# EAGLE schematic v2.2 (EAGLE 7.1.0)
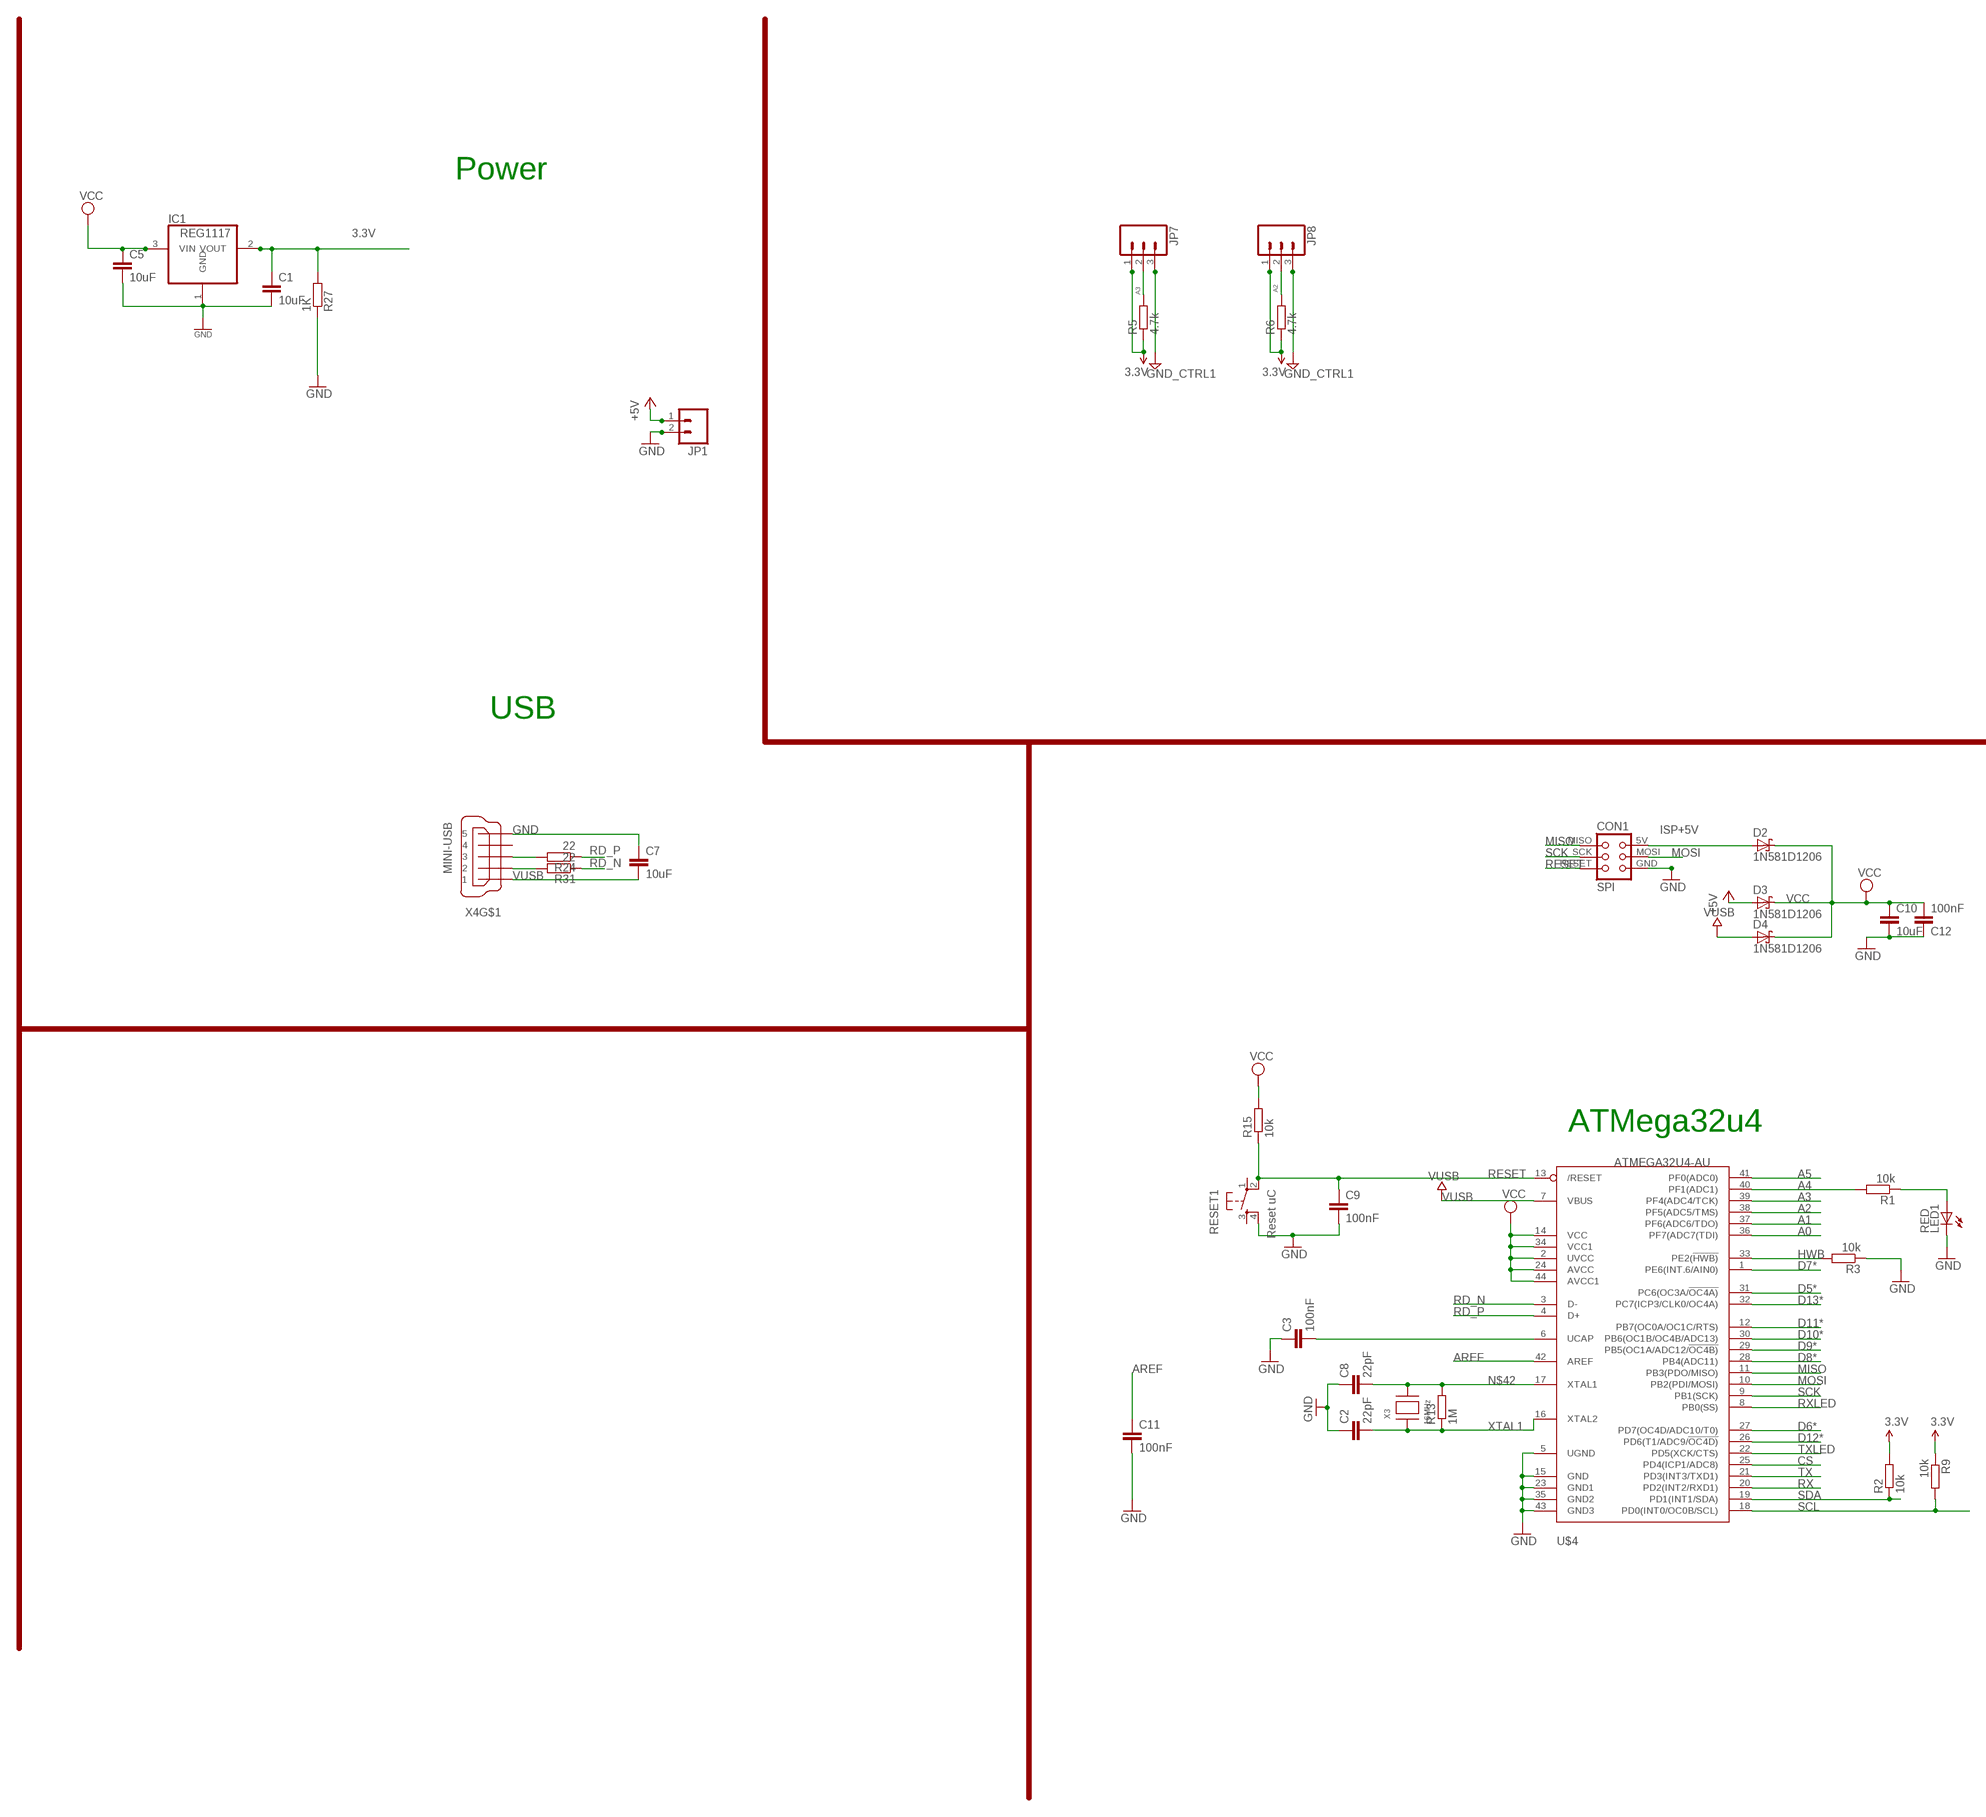
[diagram p0: schematic, sheet 1, part 1 of 2]
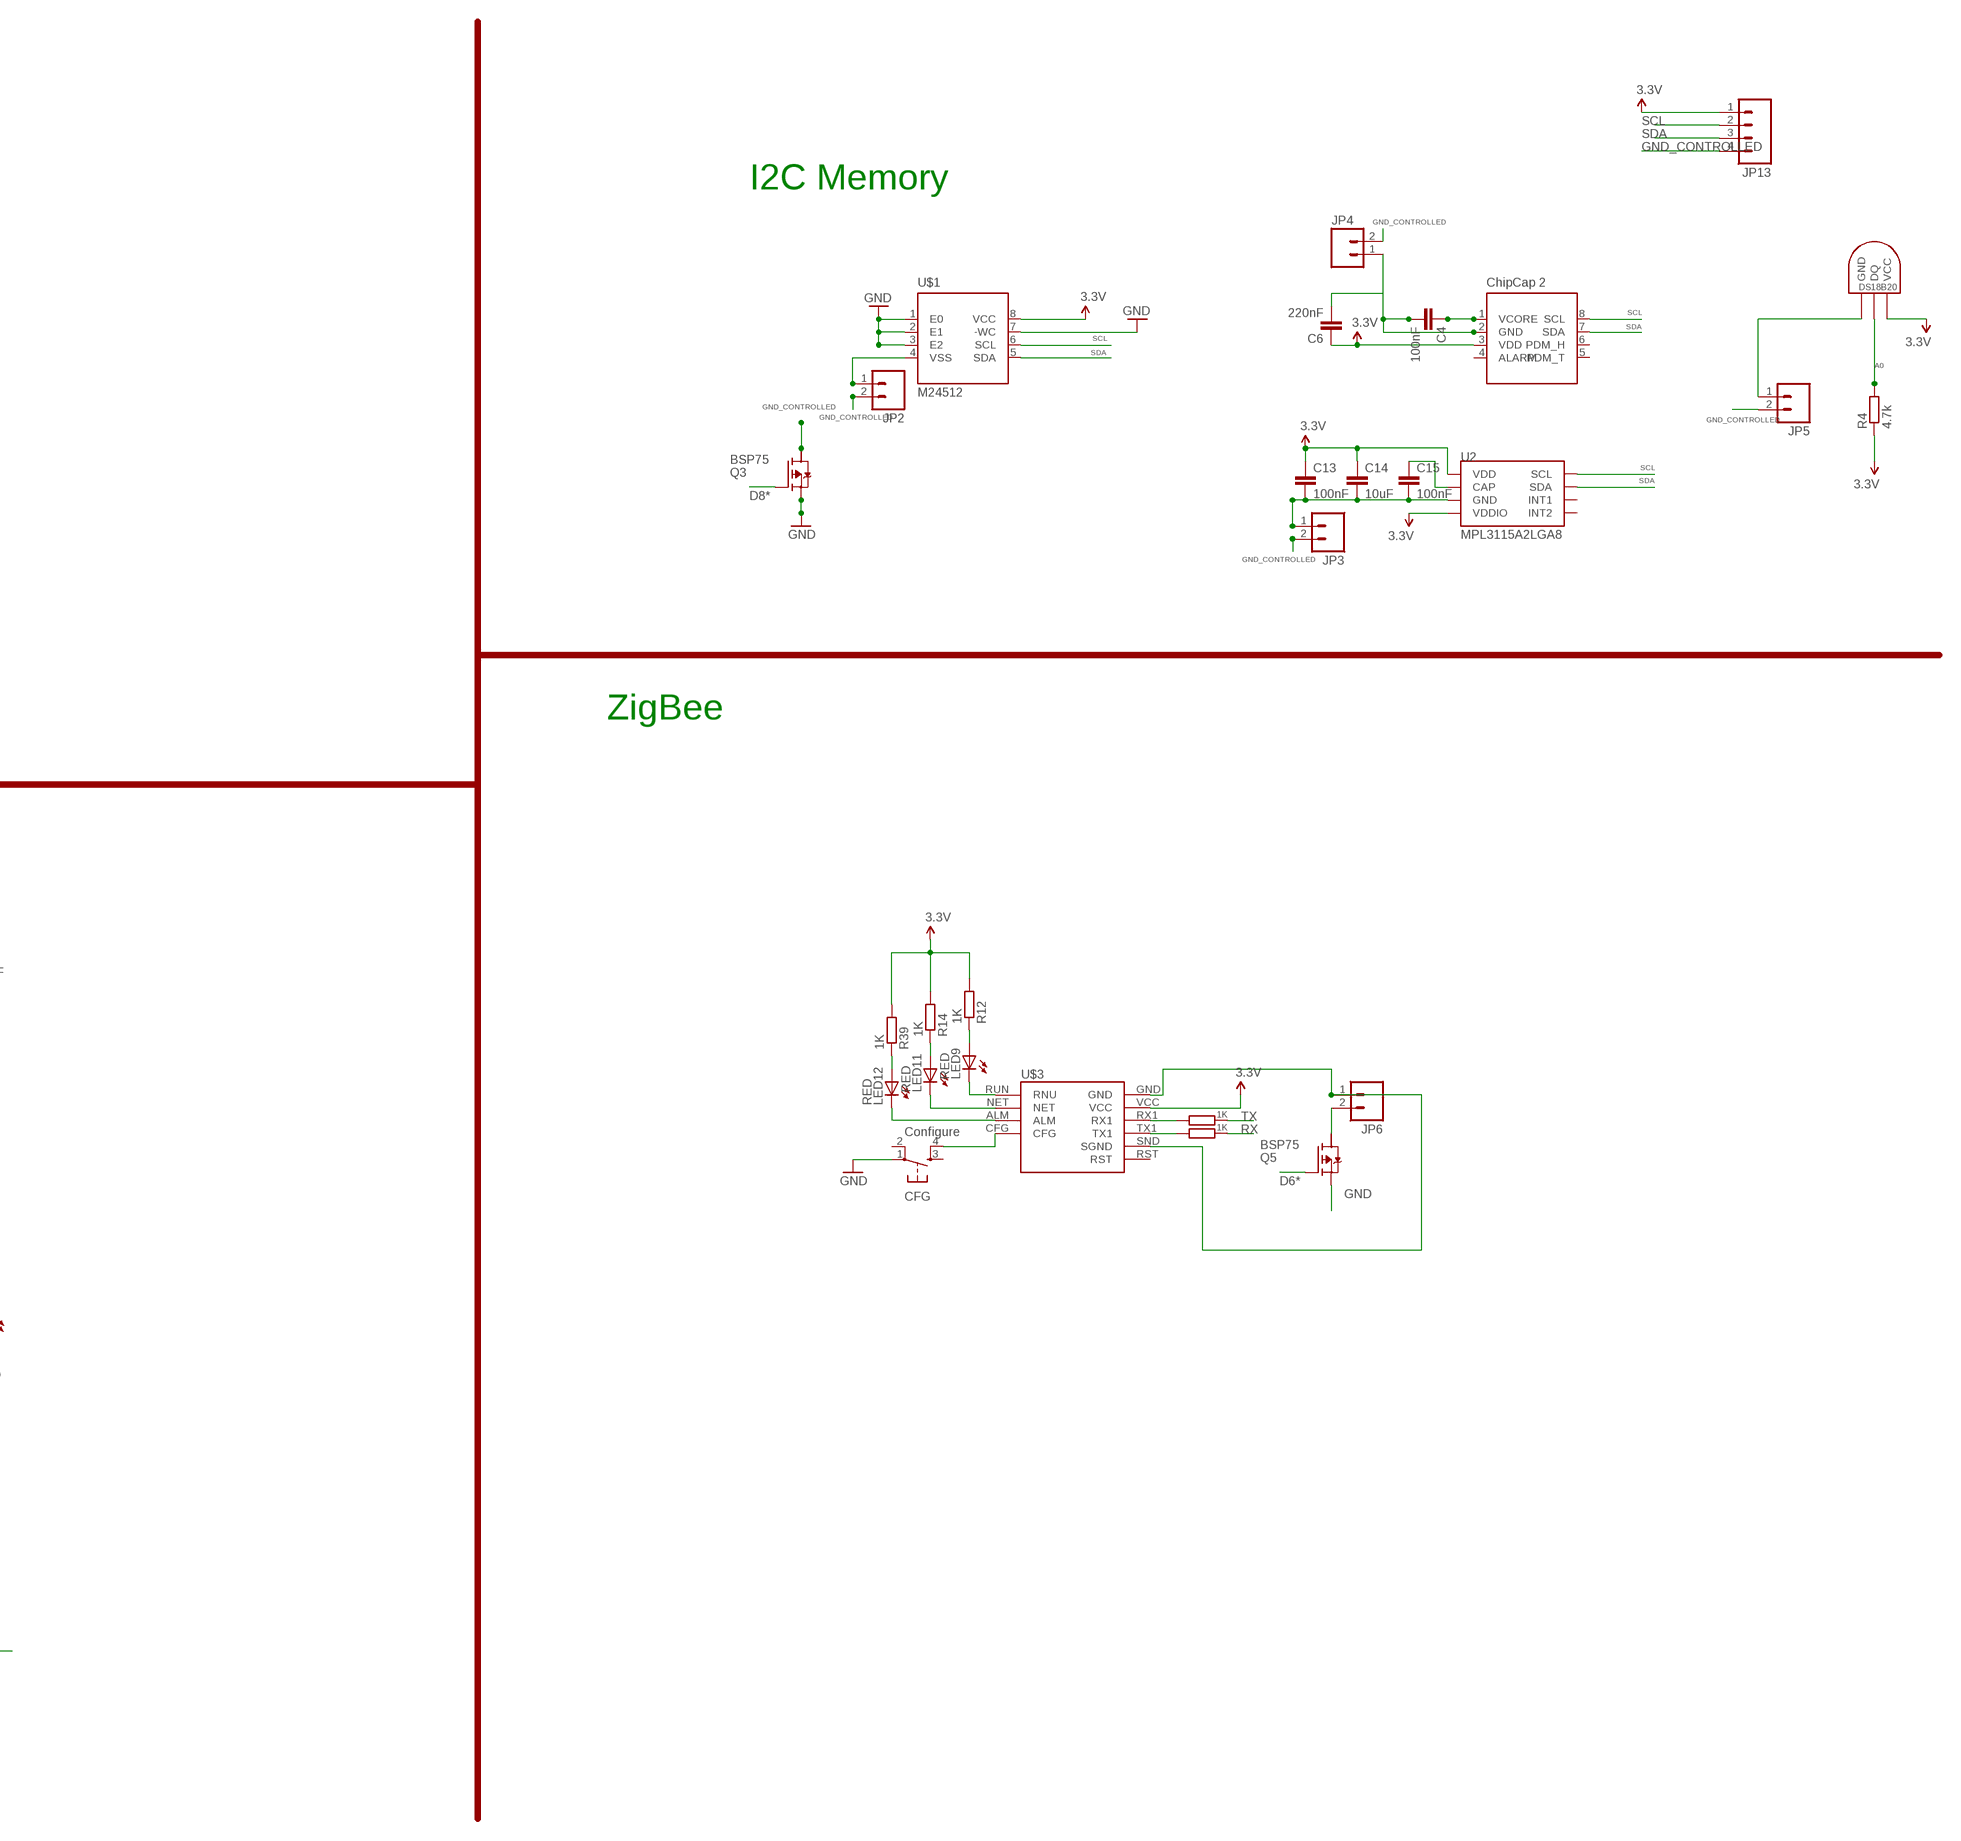
[diagram p1: schematic, sheet 1, part 2 of 2]

## Parts
C1  10uF  C-EUC1206  [C1206]
C2  22pF  C-EUC1206  [C1206]
C3  100nF  C-EUC1206  [C1206]
C4  100nF  C-EUC1206  [C1206]
C5  10uF  C-EUC1206  [C1206]
C6  220nF  C-EUC1206  [C1206]
C7  10uF  C-EUC1206  [C1206]
C8  22pF  C-EUC1206  [C1206]
C9  100nF  C-EUC1206  [C1206]
C10  10uF  C-EUC1206  [C1206]
C11  100nF  C-EUC1206  [C1206]
C12  100nF  C-EUC1206  [C1206]
C13  100nF  C-EUC1206  [C1206]
C14  10uF  C-EUC1206  [C1206]
C15  100nF  C-EUC1206  [C1206]
CFG  Configure  TAC_SWITCHSMD  [TACTILE_SWITCH_SMD]
CON1  SPI  TINYISPT  [TC2030-MCP-NL]
D2  1N581D1206  [LED-1206]
D3  1N581D1206  [LED-1206]
D4  1N581D1206  [LED-1206]
IC1  REG1117  [SOT223]
JP1  M02LOCK_LONGPADS  [1X02_LOCK_LONGPADS]
JP2  M02LOCK_LONGPADS  [1X02_LOCK_LONGPADS]
JP3  M02LOCK_LONGPADS  [1X02_LOCK_LONGPADS]
JP4  M02LOCK_LONGPADS  [1X02_LOCK_LONGPADS]
JP5  M02LOCK_LONGPADS  [1X02_LOCK_LONGPADS]
JP6  M02LOCK_LONGPADS  [1X02_LOCK_LONGPADS]
JP7  M03LONGPADS  [1X03_LONGPADS]
JP8  M03LONGPADS  [1X03_LONGPADS]
JP13  M04LOCK_LONGPADS  [1X04_LOCK_LONGPADS]
LED1  RED  LEDCHIP-LED0805  [CHIP-LED0805]
LED9  RED  LEDCHIP-LED0805  [CHIP-LED0805]
LED11  RED  LEDCHIP-LED0805  [CHIP-LED0805]
LED12  RED  LEDCHIP-LED0805  [CHIP-LED0805]
Q3  BSP75  BSP613P  [PG-SOT-223]
Q5  BSP75  BSP613P  [PG-SOT-223]
R1  10k  R-EU_M1206  [M1206]
R2  10k  R-EU_M1206  [M1206]
R3  10k  R-EU_M1206  [M1206]
R4  4.7k  R-EU_M1206  [M1206]
R5  4.7k  R-EU_M1206  [M1206]
R6  4.7k  R-EU_M1206  [M1206]
R8  1K  R-EU_R0805  [R0805]
R9  10k  R-EU_M1206  [M1206]
R11  1K  R-EU_R0805  [R0805]
R12  1K  R-EU_R0805  [R0805]
R13  1M  R-EU_R1206  [R1206]
R14  1K  R-EU_R0805  [R0805]
R15  10k  R-EU_M0805  [M0805]
R24  22  R-EU_M1206  [M1206]
R27  1K  R-EU_R0805  [R0805]
R31  22  R-EU_M1206  [M1206]
R39  1K  R-EU_R0805  [R0805]
RESET1  Reset uC  TAC_SWITCHSMD  [TACTILE_SWITCH_SMD]
U2  MPL3115A2LGA8  [LGA8]
U$1  M24512  [SO8]
U$2  CHIPCAP  [CHIPCAP]
U$3  SZ05-ZIGBEETHROUGHHOLE  [SZ05-ZIGBEE4]
U$4  ATMEGA32U4-AU  [TQFP44]
U$6  DS1820  [µSOP8]
X3  16MHz  XTALNX6035  [NX6035]
X4  MINI-USB  MINI-USB-SCHIELD-32005-201  [32005-201]

## Nets
3.3V [power]: C1.1 C6.1 C13.1 C14.1 IC1.2(VOUT) JP7.1 JP8.1 JP13.1 R2.2 R4.1 R5.1 R6.1 R9.1 R12.2 R14.2 R27.2 R39.2 U2.1(VDD) U2.4(VDDIO) U$1.8(VCC) U$2.3(VDD) U$3.VCC U$6.8(VCC)
$1: C13.2 C14.2 C15.2 JP3.1 U2.3(GND)
$2: C4.2 C6.2 JP4.1 U$2.2(GND)
$3: JP5.1 U$6.4(GND)
$12: JP2.1 U$1.4(VSS)
+5V [power]: D3.A JP1.1
A0: R4.2 U$4.36(PF7(ADC7(TDI)) U$6.1(DQ)
A1: U$4.37(PF6(ADC6/TDO))
A2: JP8.2 R6.2 U$4.38(PF5(ADC5/TMS))
A3: JP7.2 R5.2 U$4.39(PF4(ADC4/TCK))
A4: R1.2 U$4.40(PF1(ADC1))
A5: U$4.41(PF0(ADC0))
AREF: C11.1 U$4.42(AREF)
CS: U$4.25(PD4(ICP1/ADC8))
D5*: U$4.31(PC6(OC3A/!OC4A))
D6*: Q5.1(G) U$4.27(PD7(OC4D/ADC10/T0))
D7*: U$4.1(PE6(INT.6/AIN0))
D8*: Q3.1(G) U$4.28(PB4(ADC11))
D9*: U$4.29(PB5(OC1A/ADC12/!OC4B))
D10*: U$4.30(PB6(OC1B/OC4B/ADC13))
D11*: U$4.12(PB7(OC0A/OC1C/RTS))
D12*: U$4.26(PD6(T1/ADC9/!OC4D))
D13*: U$4.32(PC7(ICP3/CLK0/OC4A))
D+USB: R24.2 X4.3
D-USB: R31.2 X4.2
GND [power]: C1.2 C2.1 C3.1 C5.2 C7.1 C8.1 C9.2 C10.2 C11.2 C12.1 CFG.1 CON1.GND IC1.1(GND) JP1.2 JP7.3 JP8.3 LED1.C Q3.3(S) Q5.3(S) R3.1 R27.1 RESET1.4 U$1.1(E0) U$1.2(E1) U$1.3(E2) U$1.7(-WC) U$4.5(UGND) U$4.15(GND) U$4.23(GND1) U$4.35(GND2) U$4.43(GND3) X4.5 ; supply symbol labelled GND_CTRL1
GND1 [VIN]: LED9.C U$3.RUN(RNU)
GND2 [VIN]: LED11.C U$3.NET
GND3 [VIN]: LED12.C U$3.ALM
GND_CONTROLLED [power]: JP2.2 JP3.2 JP4.2 JP5.2 JP13.4 Q3.2(D)
HWB: R3.2 U$4.33(PE2(!HWB))
ISP+5V: CON1.5V(VCC) D2.A
MISO: CON1.MISO U$4.11(PB3(PDO/MISO))
MOSI: CON1.MOSI U$4.10(PB2(PDI/MOSI))
N$1: LED1.A R1.1
N$2: JP6.2 Q5.2(D)
N$4 [power]: JP6.1 U$3.GND U$3.SND(SGND)
N$6: C4.1 U$2.1(VCORE)
N$11: R11.2 U$3.RX1
N$13: C15.1 U2.2(CAP)
N$16: C3.2 U$4.6(UCAP)
N$24: R8.2 U$3.TX1
N$25: LED9.A R12.1
N$26: LED11.A R14.1
N$27: LED12.A R39.1
N$35: CFG.4 U$3.CFG
N$42: C8.2 R13.2 U$4.17(XTAL1) X3.P$2
RD_N: R31.1 U$4.3(D-)
RD_P: R24.1 U$4.4(D+)
RESET: C9.1 CON1.RESET R15.1 RESET1.2 U$4.13(/RESET)
RX: R8.1 U$4.20(PD2(INT2/RXD1))
RXLED: U$4.8(PB0(SS))
SCK: CON1.SCK U$4.9(PB1(SCK))
SCL: JP13.2 R9.2 U2.8(SCL) U$1.6(SCL) U$2.8(SCL) U$4.18(PD0(INT0/OC0B/SCL))
SDA: JP13.3 R2.1 U2.7(SDA) U$1.5(SDA) U$2.7(SDA) U$4.19(PD1(INT1/SDA))
TX: R11.1 U$4.21(PD3(INT3/TXD1))
TXLED: U$4.22(PD5(XCK/CTS))
VCC [fine]: C5.1 C10.1 C12.2 D2.C D3.C D4.C IC1.3(VIN) R15.2 U$4.2(UVCC) U$4.14(VCC) U$4.24(AVCC) U$4.34(VCC1) U$4.44(AVCC1)
VUSB: C7.2 D4.A U$4.7(VBUS) X4.1
XTAL1: C2.2 R13.1 U$4.16(XTAL2) X3.P$1
Unconnected: CFG.2 CFG.3 Q3.4(D) Q5.4(D) RESET1.1 RESET1.3 U2.5(INT2) U2.6(INT1) U$2.4(ALARM) U$2.5(PDM_T) U$2.6(PDM_H) U$3.RST X4.4 X4.M1(S:S1) X4.M2(S:S2) X4.M3(S:S3) X4.M4(S:S4)

## Notes on the sheet
- Power
- I2C Memory
- ZigBee
- USB
- ATMega32u4

## Library data of the parts
C1-C15 = rcl:C-EU: CAPACITOR, European symbol
CFG RESET1 = lpatiny:TAC_SWITCH: Momentary Switch Button commonly used for reset or general input. Spark Fun Electronics SKU : COM-00097
CON1 = lpatiny:TINYISP: CONNECTOR
D2-D4 = lpatiny:1N581*: 1.0A SCHOTTKY BARRIER RECTIFIER Source: http://www.diodes.com/datasheets/ds23001.pdf
IC1 = burr-brown:REG1117: 800mA and 1A Low Dropout (LDO) Positive Regulator 1.8V, 2.5V, 2.85V, 3.3V, 5V, and Adj; MPN: REG1117; OC_FARNELL: 1097566; OC_NEWARK: 14P6981
JP1-JP6 = SparkFun:M02: Header 2 Standard 2-pin 0.1" header. Use with straight break away headers (SKU : PRT-00116), right angle break away headers (PRT-00553), swiss pins (PRT-00743), machine pins (PRT-00117), and female headers (PRT-00115). Molex polarized connector foot print use with SKU : PRT-08233 with associated crimp pins and housings.
JP7 JP8 = SparkFun:M03: Header 3 Standard 3-pin 0.1" header. Use with straight break away headers (SKU : PRT-00116), right angle break away headers (PRT-00553), swiss pins (PRT-00743), machine pins (PRT-00117), and female headers (PRT-00115). Molex polarized connector foot print use with SKU : PRT-08232 with associated crimp pins and housings.
JP13 = SparkFun:M04: Header 4 Standard 4-pin 0.1" header. Use with straight break away headers (SKU : PRT-00116), right angle break away headers (PRT-00553), swiss pins (PRT-00743), machine pins (PRT-00117), and female headers (PRT-00115). Molex polarized connector foot print use with SKU : PRT-08231 with associated crimp pins and housings. 1MM SMD Version SKU: PRT-10208
LED1 LED9 LED11 LED12 = adafruit:LED: LED OSRAM: - CHIPLED LG R971, LG N971, LY N971, LG Q971, LY Q971, LO R971, LY R971 LH N974, LH R974 LS Q976, LO Q976, LY Q976 LO Q996 - Hyper CHIPLED LW Q18S LB Q993, LB Q99A, LB R99A - SideLED LS A670, LO A670, LY A670, LG A670, LP A670 LB A673, LV A673, LT A673, LW A673 LH A674 LY A675 LS A676, LA A676, LO A676, LY A676, LW A676 LS A679, LY A679, LG A679 - Hyper Micro SIDELED® LS Y876, LA Y876, LO Y876, LY Y876 LT Y87S - SmartLED LW L88C, LW L88S LB L89C, LB L89S, LG L890 LS L89K, LO L89K, LY L89K LS L896, LA L896, LO L896, LY L896 - TOPLED LS T670, LO T670, LY T670, LG T670, LP T670 LSG T670, LSP T670, LSY T670, LOP T670, LYG T670 LG T671, LOG T671, LSG T671 LB T673, LV T673, LT T673, LW T673 LH T674 LS T676, LA T676, LO T676, LY T676, LB T676, LH T676, LSB T676, LW T676 LB T67C, LV T67C, LT T67C, LS T67K, LO T67K, LY T67K, LW E67C LS E67B, LA E67B, LO E67B, LY E67B, LB E67C, LV E67C, LT E67C LW T67C LS T679, LY T679, LG T679 LS T770, LO T770, LY T770, LG T770, LP T770 LB T773, LV T773, LT T773, LW T773 LH T774 LS E675, LA E675, LY E675, LS T675 LS T776, LA T776, LO T776, LY T776, LB T776 LHGB T686 LT T68C, LB T68C - Hyper Mini TOPLED® LB M676 - Mini TOPLED Santana® LG M470 LS M47K, LO M47K, LY M47K Source: http://www.osram.convergy.de/
Q3 Q5 = infineon:BSP613P: SIPMOS (R) Small-Signal-Transistor P-Channel (2 Drain) Source: http://www.infineon.com/dgdl/BSP613P_Rev2.4.pdf; OC_FARNELL: unknown; OC_NEWARK: unknown
R1-R6 R9 R15 R24 R31 = resistor:R-EU_: RESISTOR, European symbol
R8 R11-R14 R27 R39 = rcl:R-EU_: RESISTOR, European symbol
U2 = SparkFun-Sensors-hacked:MPL3115A2: Altimeter/Pressure Sensor, I2C, 1.95V-3.6V supply, 50 to 110kPa
U$1 = lpatiny:M24512
U$2 = lpatiny:CHIPCAP
U$3 = lpatiny:SZ05-ZIGBEE
U$4 = adafruit:ATMEGA32U4: http://www.ladyada.net/library/eagle
U$6 = Ava:DS1820: DS18B20 Programmable Resolution 1-Wire Digital Thermometer Description The DS18B20 digital thermometer provides 9-bit to 12-bit Celsius temperature measurements and has an alarm function with nonvolatile user-programmable upper and lower trigger points. The DS18B20 communicates over a 1-Wire® bus that by definition requires only one data line (and ground) for communication with a central microprocessor. It has an operating temperature range of -55°C to +125°C and is accurate to ±0.5°C over the range of -10°C to +85°C. In addition, the DS18B20 can derive power directly from the data line ("parasite power"), eliminating the need for an external power supply. Each DS18B20 has a unique 64-bit serial code, which allows multiple DS18B20s to function on the same 1-Wire bus. Thus, it is simple to use one microprocessor to control many DS18B20s distributed over a large area. Applications that can benefit from this feature include HVAC environmental controls, temperature monitoring systems inside buildings, equipment, or machinery, and process monitoring and control systems.
X3 = lpatiny:XTAL: Low cost SMT crystals, no capacitors included http://www.ladyada.net/library/eagle
X4 = con-cypressindustries:MINI-USB-SCHIELD-: MINI USB-B Conector Source: www.cypressindustries.com; OC_FARNELL: unknown; OC_NEWARK: unknown

## Net classes
0 default: width 0.305 mm
1 power: width 0.61 mm
2 VIN: width 0.457 mm
3 fine: width 0.305 mm
4 aref: width 0.305 mm